# EAGLE design AnalogFrontend_v1 (EAGLE 9.6.2)

## Sheet 1 of 5: MAIN
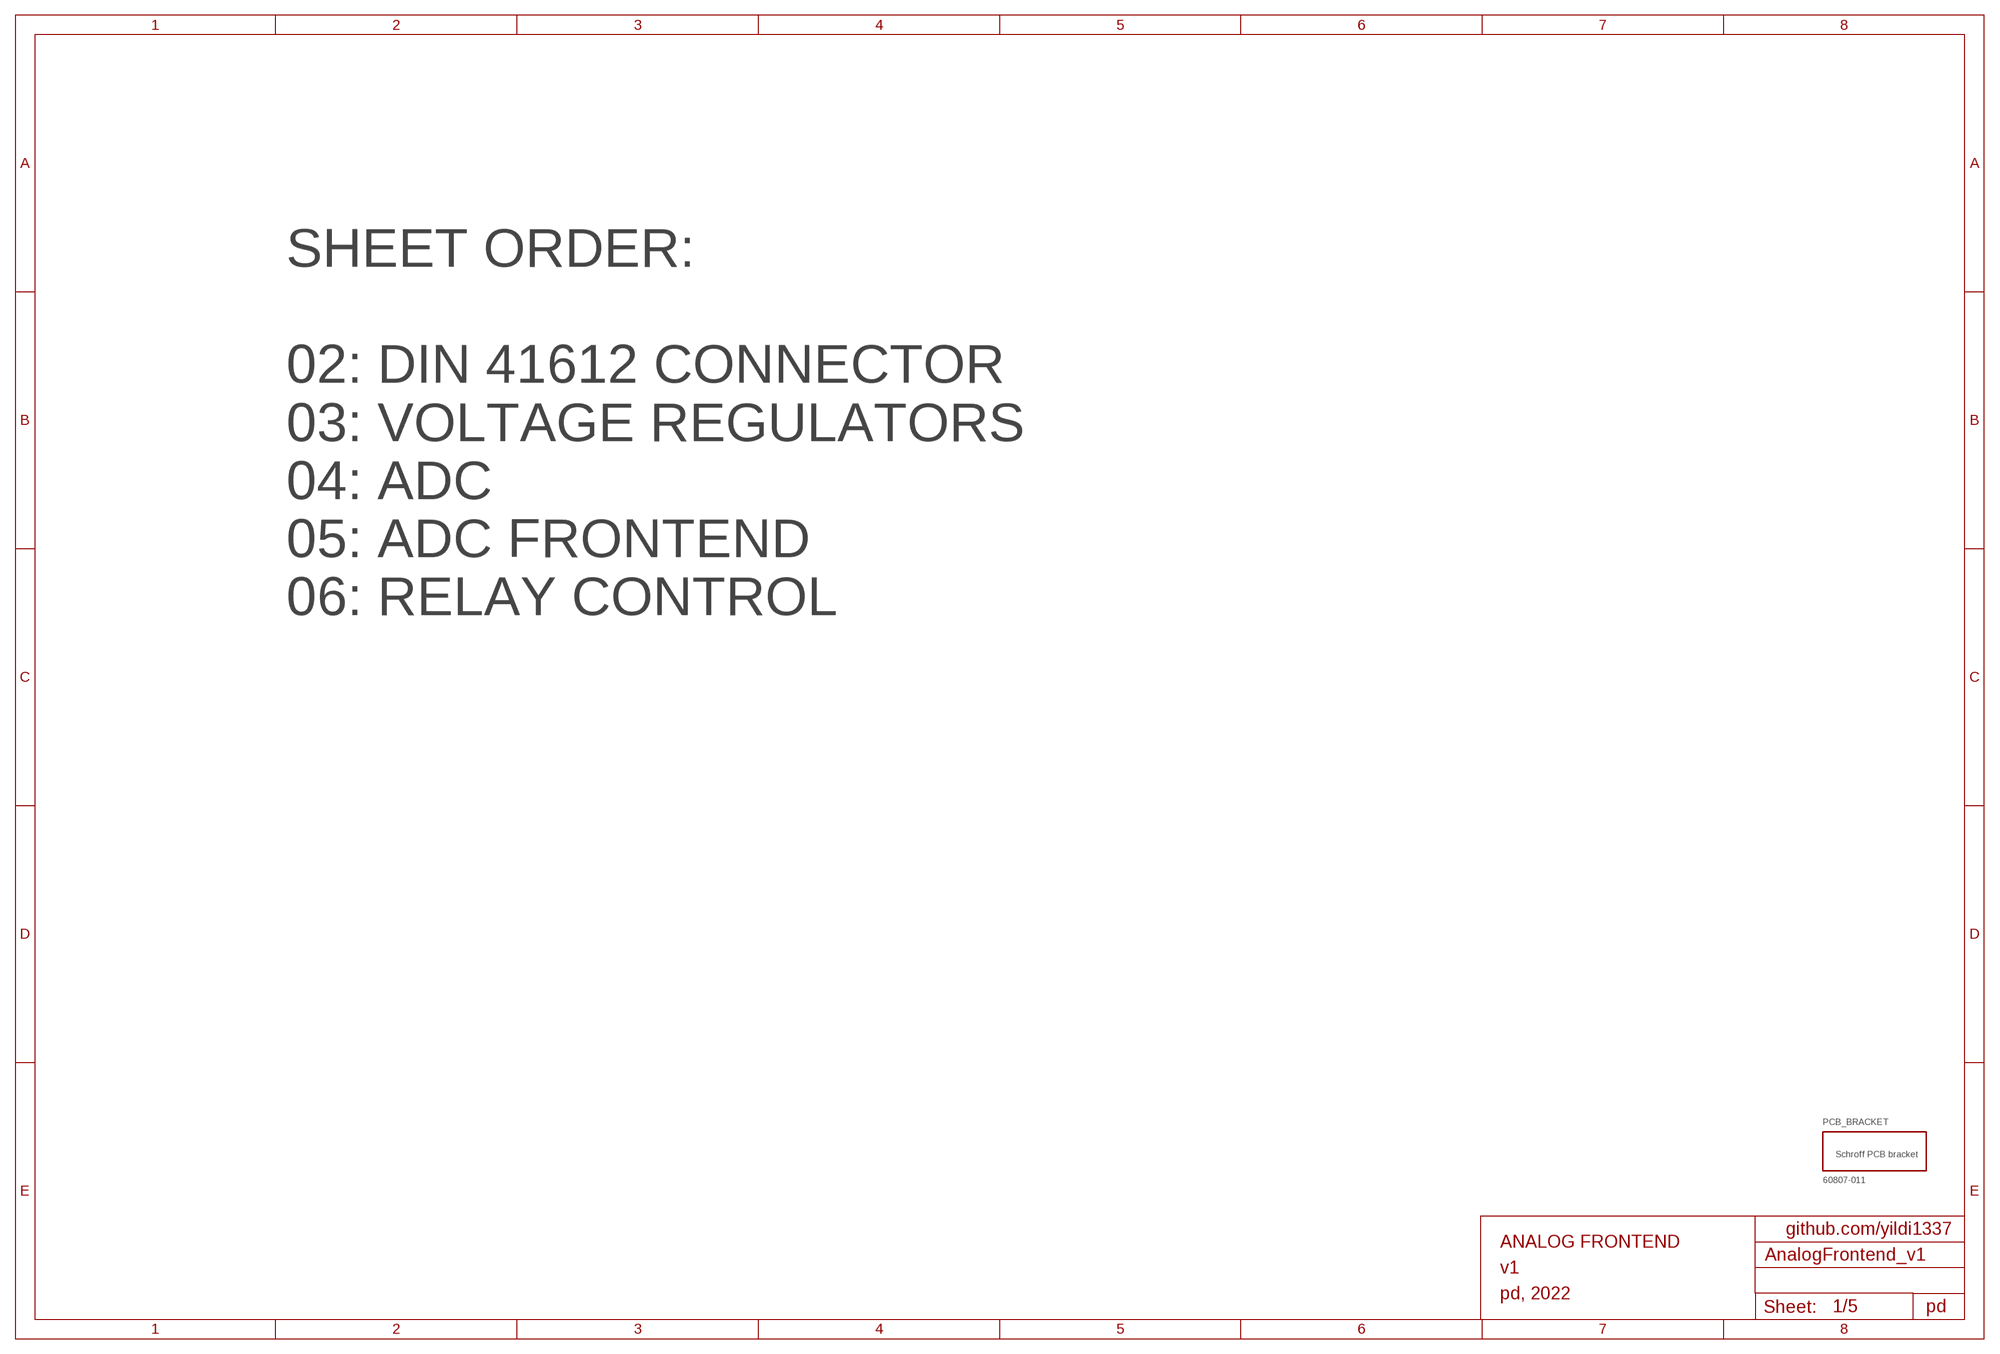
[diagram p0: schematic, sheet 1]

### Parts
PCB_BRACKET  60807-011  [60807-011]

### Notes on the sheet
- SHEET ORDER:
  
  02: DIN 41612 CONNECTOR
  03: VOLTAGE REGULATORS
  04: ADC
  05: ADC FRONTEND
  06: RELAY CONTROL
- github.com/yildi1337
- ANALOG FRONTEND
- v1
- pd, 2022
- pd

## Sheet 2 of 5: DIN 41612 CONNECTOR
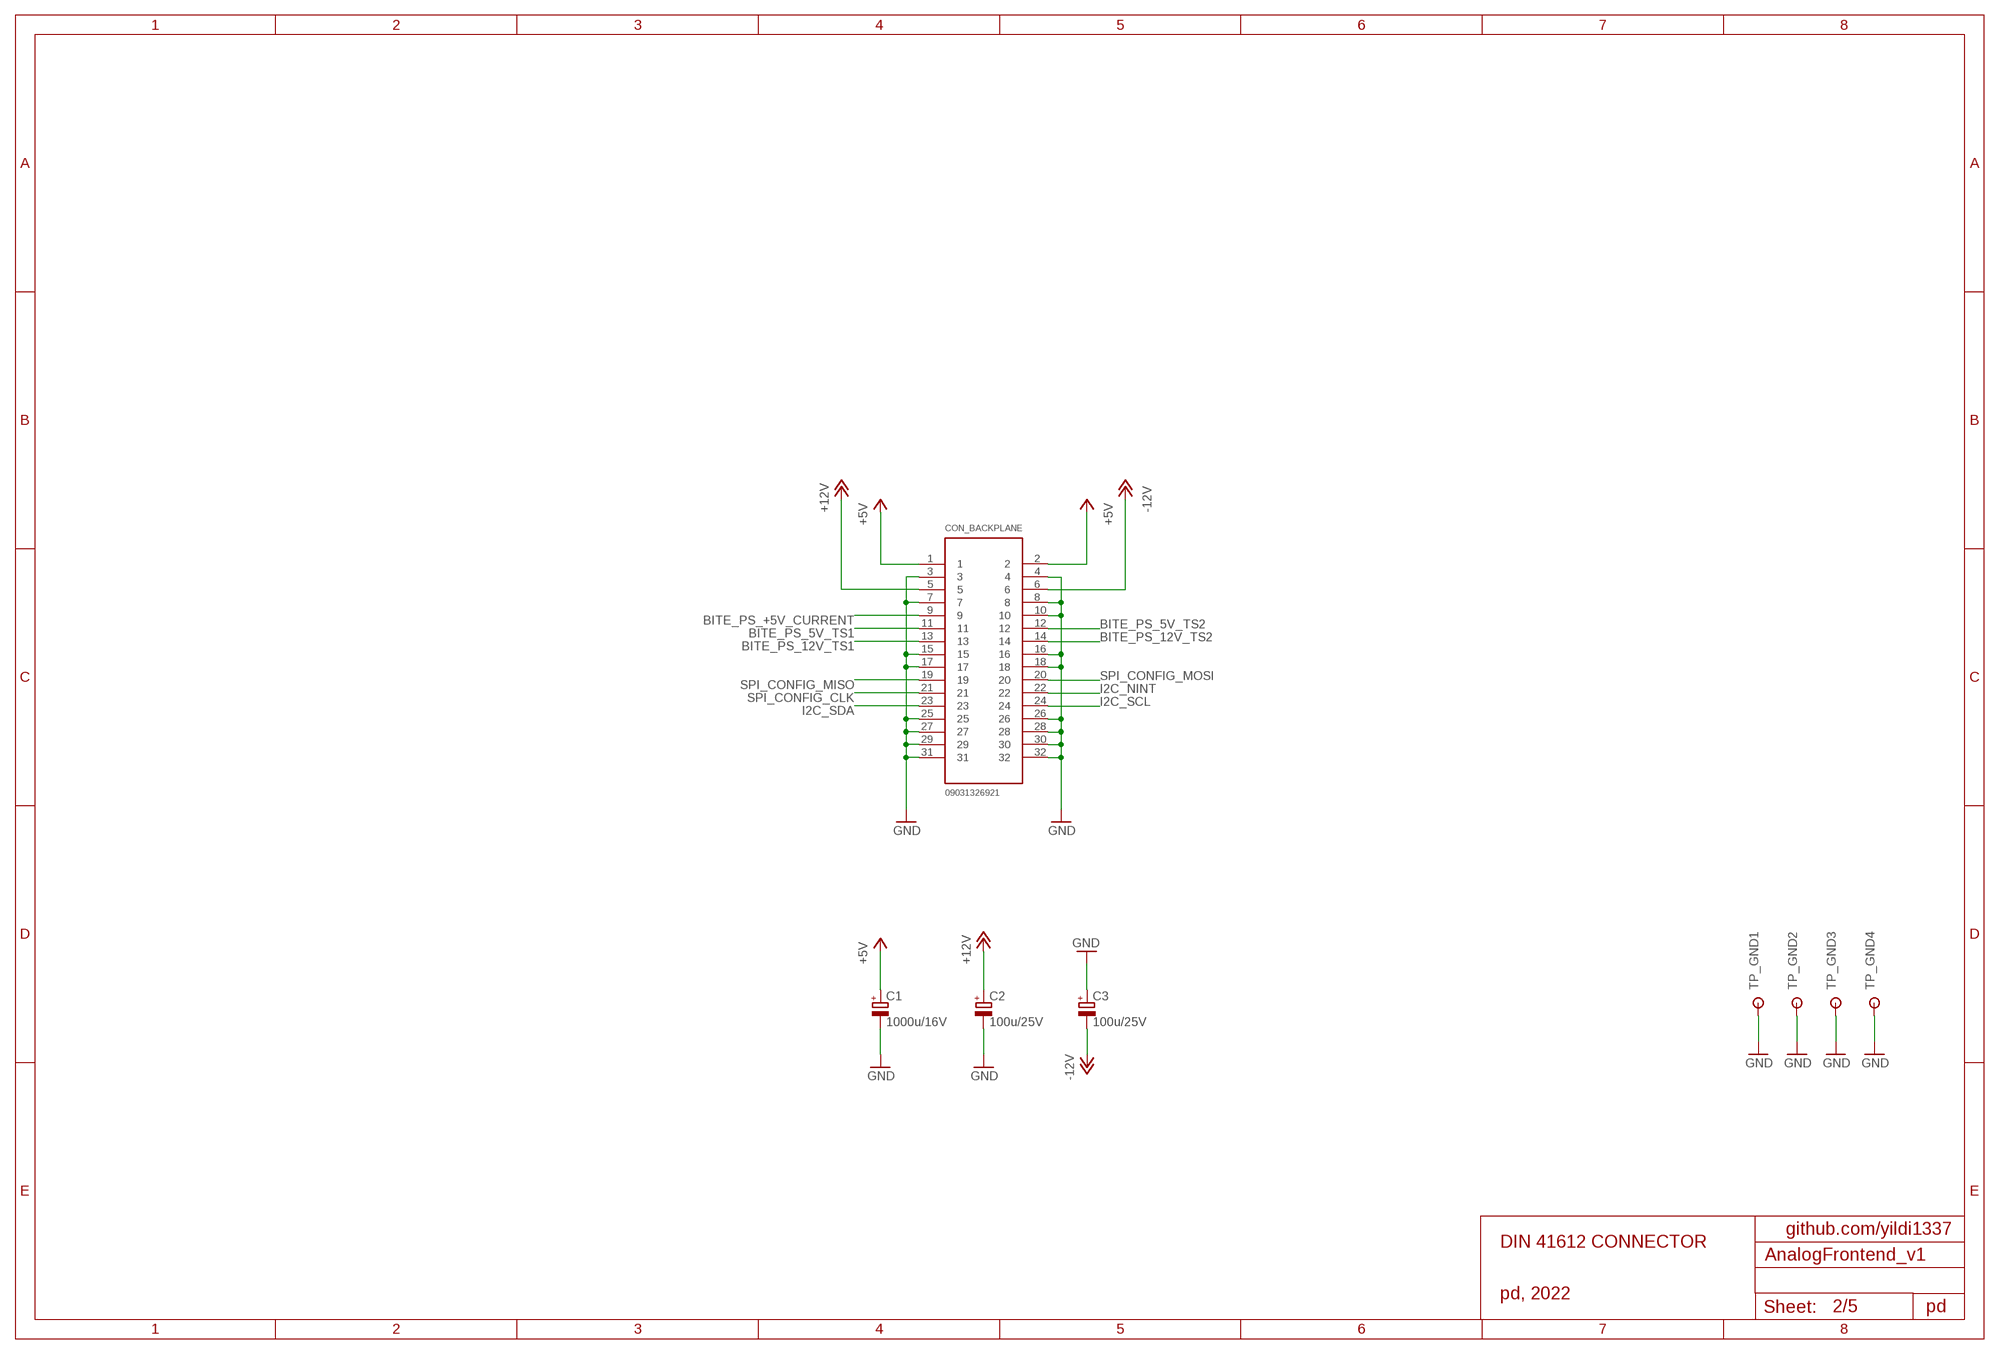
[diagram p1: schematic, sheet 2]

### Parts
C1  1000u/16V  CPOL-EU153CLV-1010  [153CLV-1010]
C2  100u/25V  CPOL-EU153CLV-0810  [153CLV-0810]
C3  100u/25V  CPOL-EU153CLV-0810  [153CLV-0810]
CON_BACKPLANE  09031326921  [09031326921]
TP_GND1  RSPRO-1MM-TERMINAL-POST-2622034  [RSPRO-1MM-TERMINAL-POST-2622034]
TP_GND2  RSPRO-1MM-TERMINAL-POST-2622034  [RSPRO-1MM-TERMINAL-POST-2622034]
TP_GND3  RSPRO-1MM-TERMINAL-POST-2622034  [RSPRO-1MM-TERMINAL-POST-2622034]
TP_GND4  RSPRO-1MM-TERMINAL-POST-2622034  [RSPRO-1MM-TERMINAL-POST-2622034]

### Nets
+5V: C1.+ CON_BACKPLANE.1 CON_BACKPLANE.2 ; also sheet 3,4,5
+12V: C2.+ CON_BACKPLANE.5 ; also sheet 3
-12V: C3.- CON_BACKPLANE.6 ; also sheet 3
BITE_PS_5V_TS1: CON_BACKPLANE.11
BITE_PS_5V_TS2: CON_BACKPLANE.12
BITE_PS_12V_TS1: CON_BACKPLANE.13
BITE_PS_12V_TS2: CON_BACKPLANE.14
BITE_PS_+5V_CURRENT: CON_BACKPLANE.9
GND: C1.- C2.- C3.+ CON_BACKPLANE.3 CON_BACKPLANE.4 CON_BACKPLANE.7 CON_BACKPLANE.8 CON_BACKPLANE.10 CON_BACKPLANE.15 CON_BACKPLANE.16 CON_BACKPLANE.17 CON_BACKPLANE.18 CON_BACKPLANE.25 CON_BACKPLANE.26 CON_BACKPLANE.27 CON_BACKPLANE.28 CON_BACKPLANE.29 CON_BACKPLANE.30 CON_BACKPLANE.31 CON_BACKPLANE.32 TP_GND1.P$1 TP_GND2.P$1 TP_GND3.P$1 TP_GND4.P$1 ; also sheet 3,4,5
I2C_NINT: CON_BACKPLANE.22 ; also sheet 5
I2C_SCL: CON_BACKPLANE.24 ; also sheet 5
I2C_SDA: CON_BACKPLANE.23 ; also sheet 5
SPI_CONFIG_CLK: CON_BACKPLANE.21 ; also sheet 5
SPI_CONFIG_MISO: CON_BACKPLANE.19 ; also sheet 5
SPI_CONFIG_MOSI: CON_BACKPLANE.20 ; also sheet 5

### Notes on the sheet
- github.com/yildi1337
- DIN 41612 CONNECTOR
- pd, 2022
- pd

## Sheet 3 of 5: VOLTAGE REGULATORS
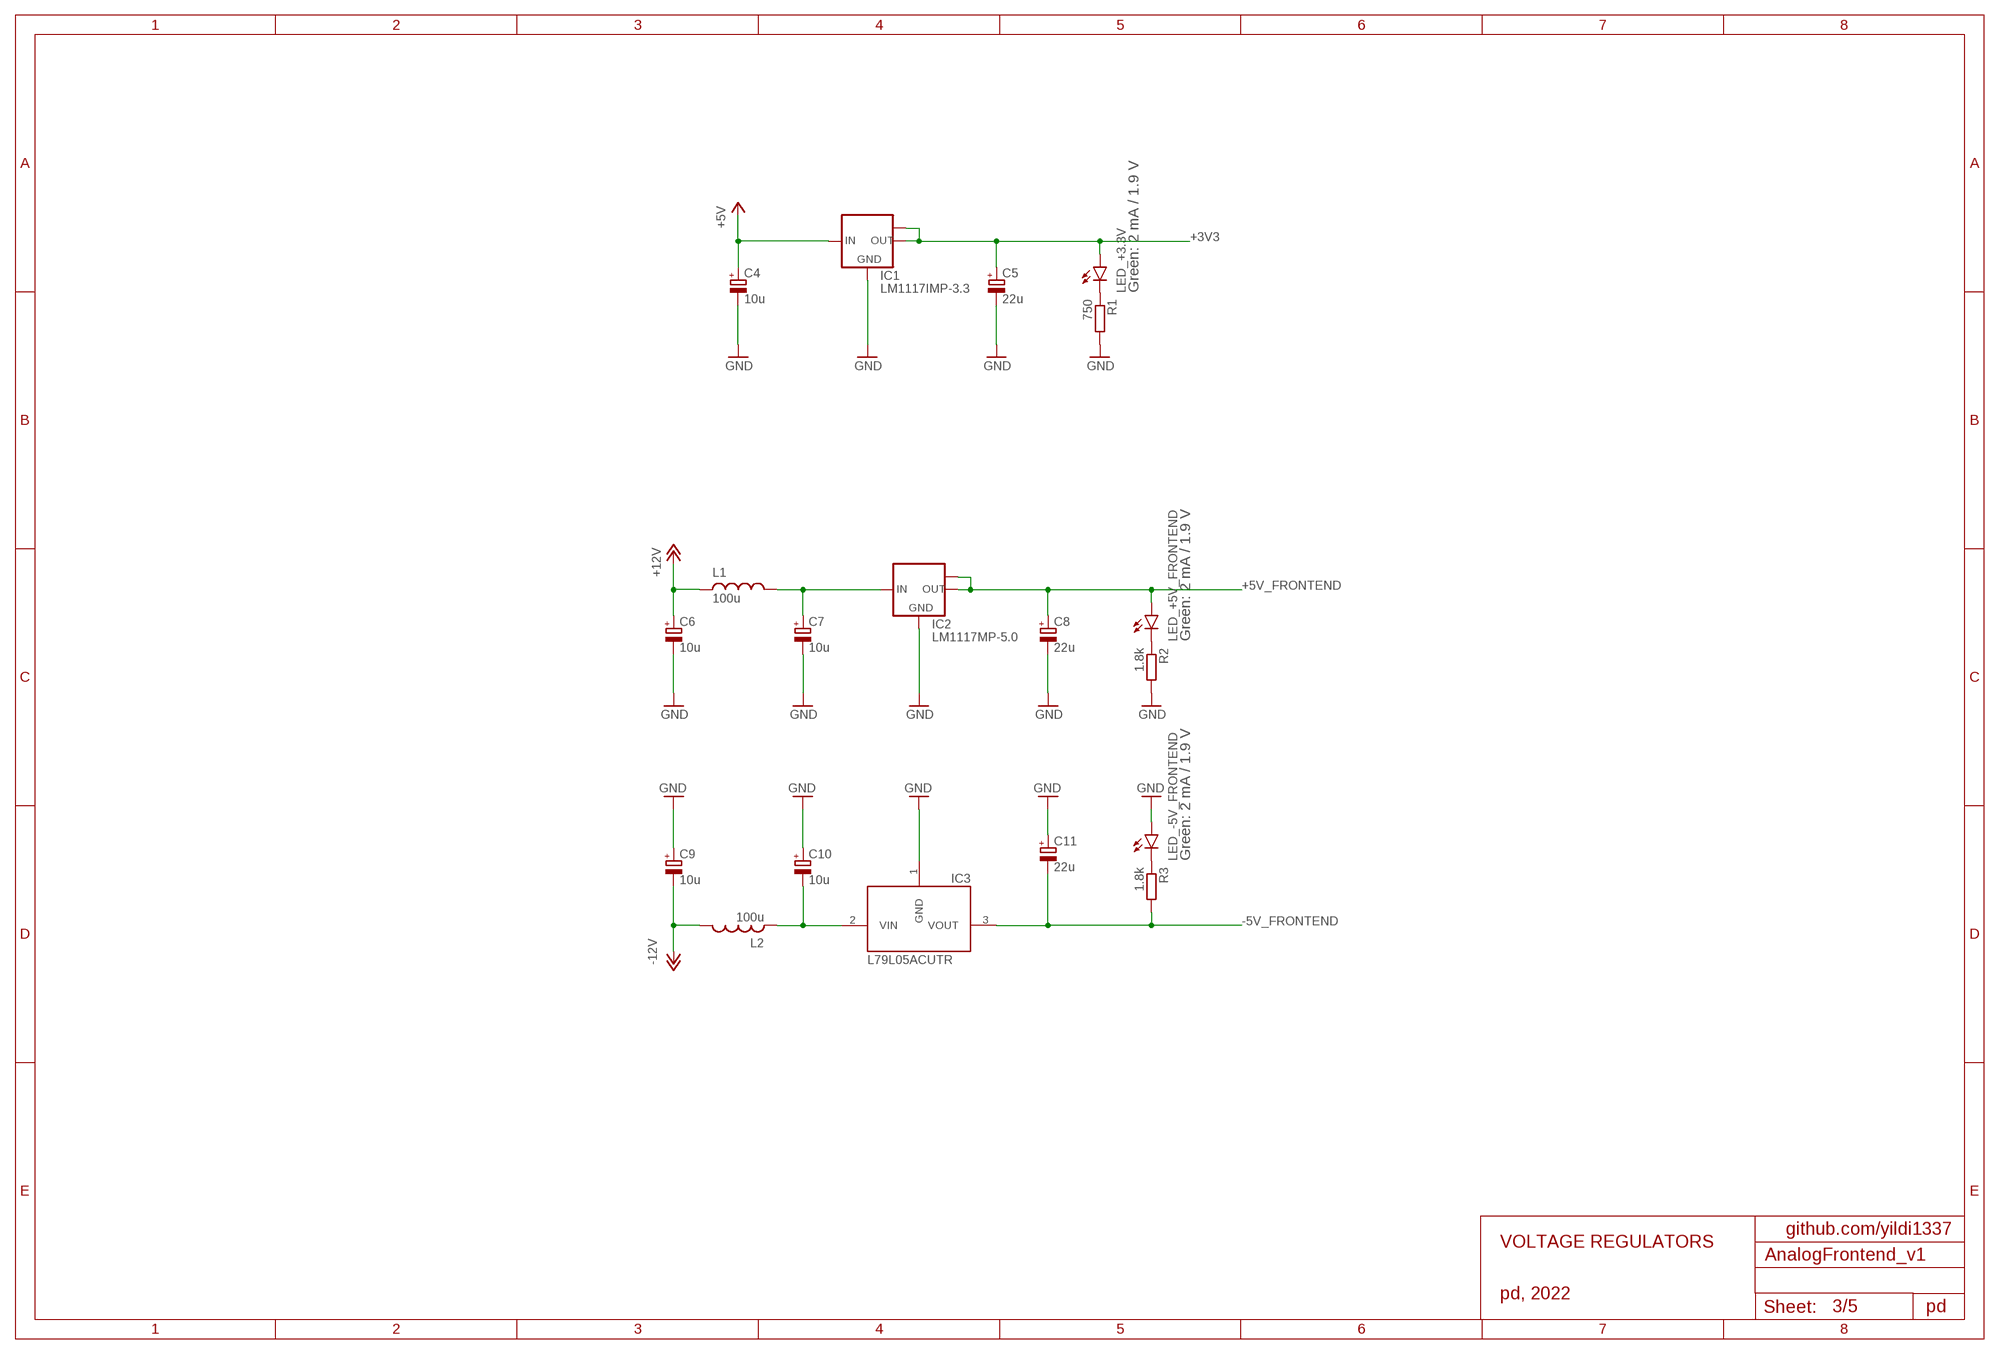
[diagram p2: schematic, sheet 3]

### Parts
C4  10u  CPOL-EUCT3216  [CT3216]
C5  22u  CPOL-EUCT6032  [CT6032]
C6  10u  CPOL-EUCT3216  [CT3216]
C7  10u  CPOL-EUCT3216  [CT3216]
C8  22u  CPOL-EUCT6032  [CT6032]
C9  10u  CPOL-EUCT3216  [CT3216]
C10  10u  CPOL-EUCT3216  [CT3216]
C11  22u  CPOL-EUCT6032  [CT6032]
IC1  LM1117IMP-3.3  LM1117IMPX-3.3  [SOT223]
IC2  LM1117MP-5.0  LM1117MPX-5.0  [SOT223]
IC3  L79L05ACUTR  [L79L05ACUTR]
L1  100u  VLS6045AF-101M  [VLS6045AF-101M]
L2  100u  VLS6045AF-101M  [VLS6045AF-101M]
LED_+3.3V  LEDCHIP-LED0603  [CHIP-LED0603]
LED_+5V_FRONTEND  LEDCHIP-LED0603  [CHIP-LED0603]
LED_-5V_FRONTEND  LEDCHIP-LED0603  [CHIP-LED0603]
R1  750  R-EU_R0603  [R0603]
R2  1.8k  R-EU_R0603  [R0603]
R3  1.8k  R-EU_R0603  [R0603]

### Nets
+3V3: C5.+ IC1.2(OUT) IC1.TAB(OUT1) LED_+3.3V.A ; also sheet 5
+5V: C4.+ IC1.3(IN) ; also sheet 2,4,5
+5V_FRONTEND: C8.+ IC2.2(OUT) IC2.TAB(OUT1) LED_+5V_FRONTEND.A ; also sheet 4
+12V: C6.+ L1.1 ; also sheet 2
-5V_FRONTEND: C11.- IC3.3(VOUT) R3.2 ; also sheet 4
-12V: C9.- L2.2 ; also sheet 2
GND: C4.- C5.- C6.- C7.- C8.- C9.+ C10.+ C11.+ IC1.1(GND) IC2.1(GND) IC3.1(GND) LED_-5V_FRONTEND.A R1.2 R2.2 ; also sheet 2,4,5
N$12: LED_+5V_FRONTEND.C R2.1
N$13: C7.+ IC2.3(IN) L1.2
N$15: C10.- IC3.2(VIN) L2.1
N$23: LED_-5V_FRONTEND.C R3.1
N$49: LED_+3.3V.C R1.1

### Notes on the sheet
- Green: 2 mA / 1.9 V
- Green: 2 mA / 1.9 V
- Green: 2 mA / 1.9 V
- github.com/yildi1337
- VOLTAGE REGULATORS
- pd, 2022
- pd

## Sheet 4 of 5: ADC FRONTEND
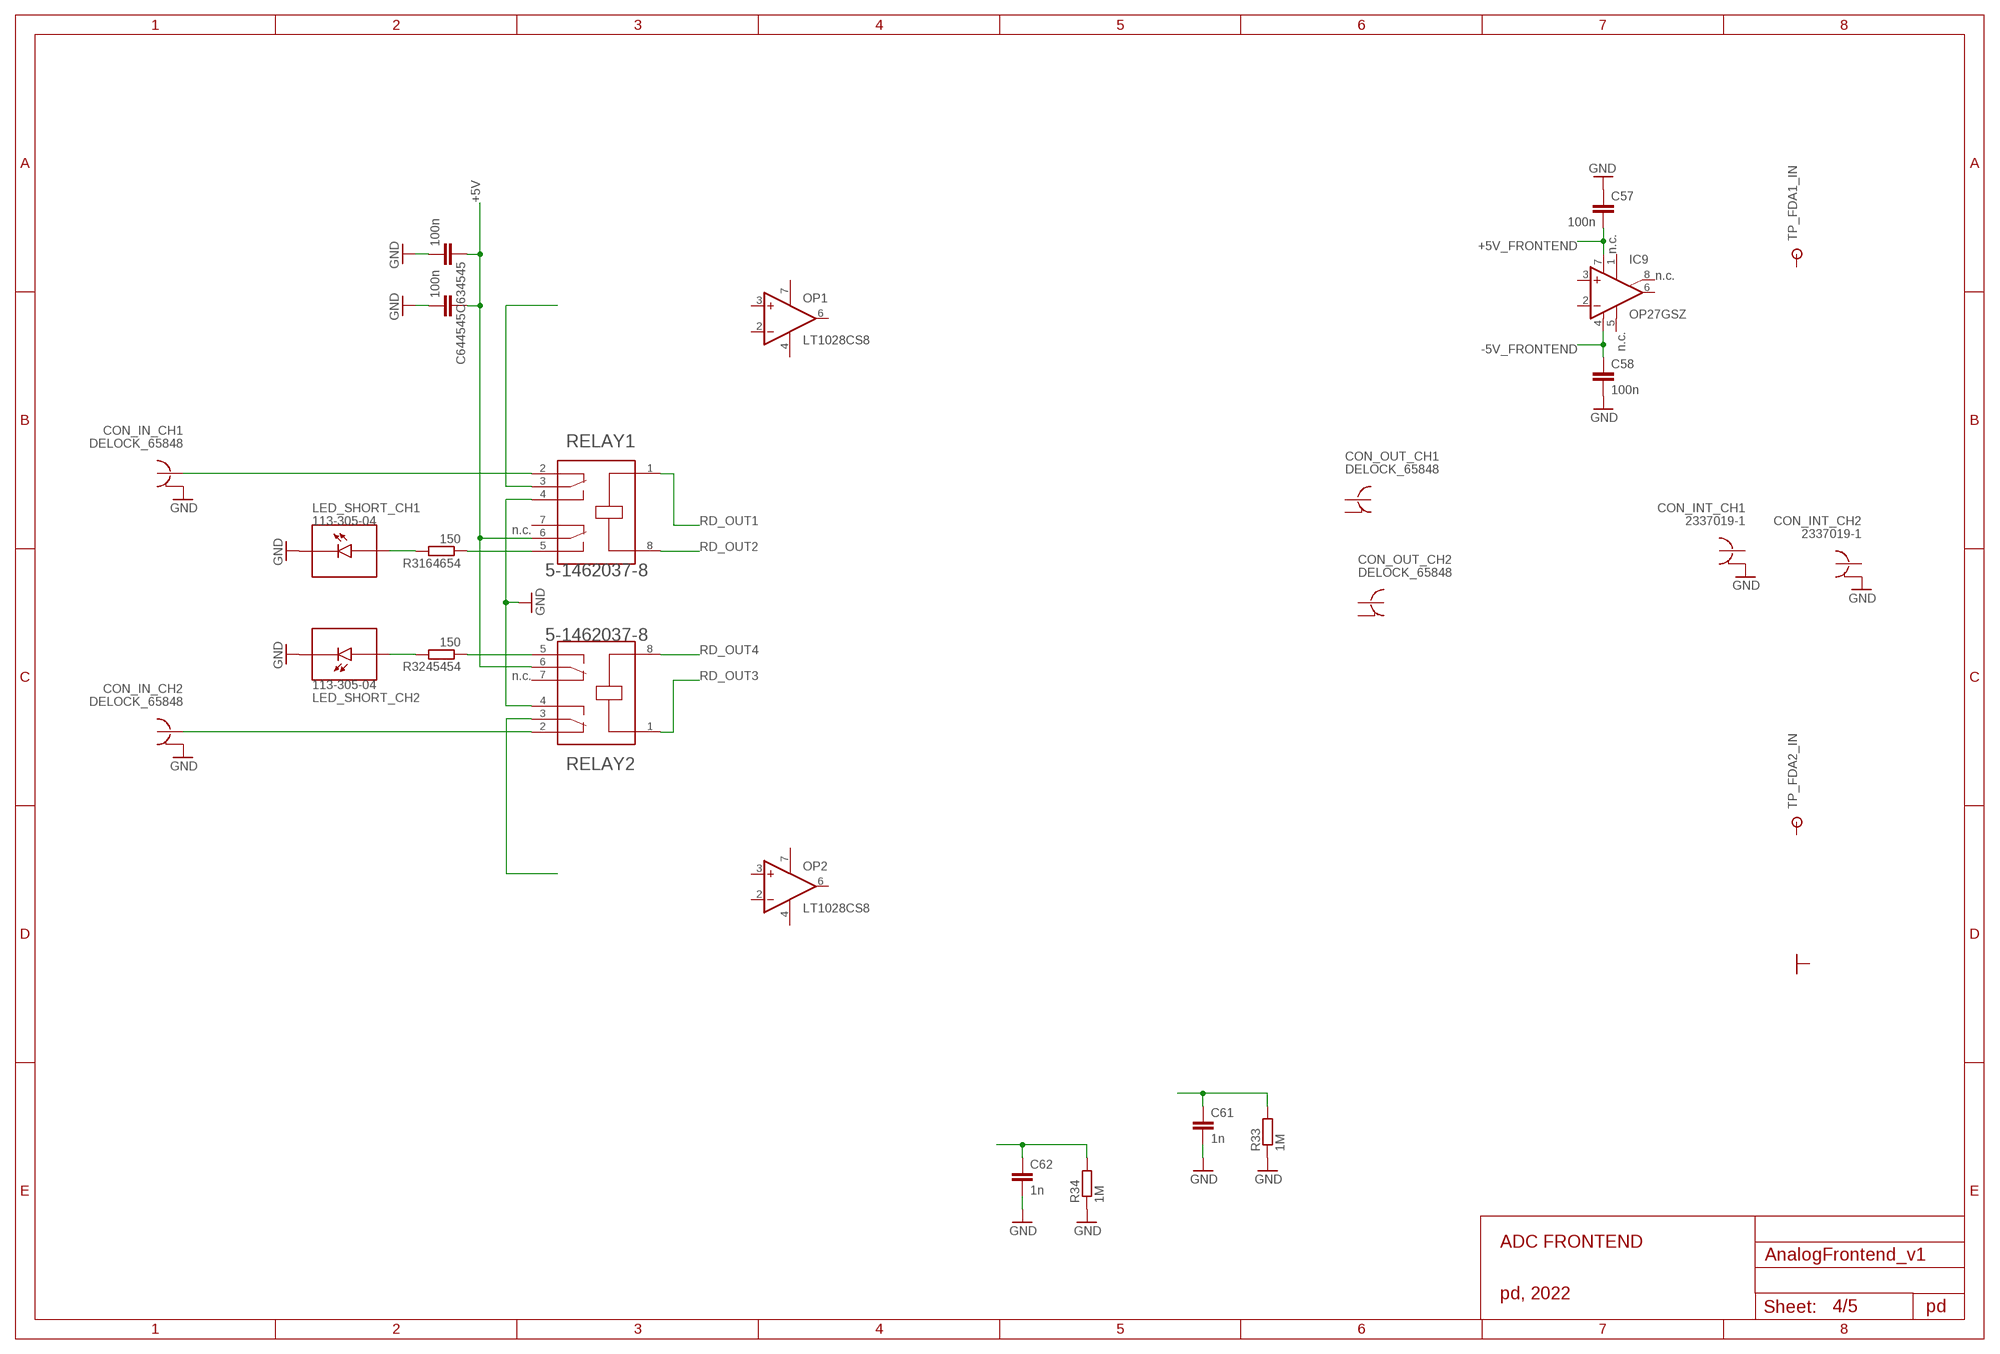
[diagram p3: schematic, sheet 4]

### Parts
C57  100n  C-EUC0603  [C0603]
C58  100n  C-EUC0603  [C0603]
C61  1n  C-EUC0603  [C0603]
C62  1n  C-EUC0603  [C0603]
C634545  100n  C-EUC0603  [C0603]
C644545  100n  C-EUC0603  [C0603]
CON_IN_CH1  DELOCK_65848  [DELOCK_65848]
CON_IN_CH2  DELOCK_65848  [DELOCK_65848]
CON_INT_CH1  2337019-1  [2337019-1]
CON_INT_CH2  2337019-1  [2337019-1]
CON_OUT_CH1  DELOCK_65848  [DELOCK_65848]
CON_OUT_CH2  DELOCK_65848  [DELOCK_65848]
IC9  OP27GSZ  OP27D  [SO08]
LED_SHORT_CH1  113-305-04  [113-305-04]
LED_SHORT_CH2  113-305-04  [113-305-04]
OP1  LT1028CS8  [LT1028CS8]
OP2  LT1028CS8  [LT1028CS8]
R33  1M  R-EU_R0603  [R0603]
R34  1M  R-EU_R0603  [R0603]
R3164654  150  R-EU_R0603  [R0603]
R3245454  150  R-EU_R0603  [R0603]
RELAY1  5-1462037-8  [5-1462037-8]
RELAY2  5-1462037-8  [5-1462037-8]
TP_FDA1_IN  RSPRO-1MM-TERMINAL-POST-2622034  [RSPRO-1MM-TERMINAL-POST-2622034]
TP_FDA2_IN  RSPRO-1MM-TERMINAL-POST-2622034  [RSPRO-1MM-TERMINAL-POST-2622034]

### Nets
+5V: C634545.1 C644545.1 RELAY1.6 RELAY2.6 ; also sheet 2,3,5
+5V_FRONTEND: C57.2 IC9.7(V+) ; also sheet 3
-5V_FRONTEND: C58.1 IC9.4(V-) ; also sheet 3
GND: C57.1 C58.2 C61.2 C62.2 C634545.2 C644545.2 CON_IN_CH1.G1(G) CON_IN_CH1.G2(G) CON_IN_CH1.G3(G) CON_IN_CH1.G4(G) CON_IN_CH2.G1(G) CON_IN_CH2.G2(G) CON_IN_CH2.G3(G) CON_IN_CH2.G4(G) CON_INT_CH1.G1(GND) CON_INT_CH1.G2(GND) CON_INT_CH2.G1(GND) CON_INT_CH2.G2(GND) LED_SHORT_CH1.-(C) LED_SHORT_CH2.-(C) R33.1 R34.1 RELAY1.4 RELAY2.4 ; also sheet 2,3,5
N$20: C61.1 R33.2
N$27: C62.1 R34.2
N$29: RELAY1.3
N$30: RELAY2.3
N$54: CON_IN_CH1.S RELAY1.2
N$55: CON_IN_CH2.S RELAY2.2
N$56: LED_SHORT_CH1.+(A) R3164654.2
N$58: LED_SHORT_CH2.+(A) R3245454.2
N$59: R3245454.1 RELAY2.5
N$60: R3164654.1 RELAY1.5
RD_OUT1: RELAY1.1 ; also sheet 5
RD_OUT2: RELAY1.8 ; also sheet 5
RD_OUT3: RELAY2.1 ; also sheet 5
RD_OUT4: RELAY2.8 ; also sheet 5
Unconnected: CON_INT_CH1.S(SIG) CON_INT_CH2.S(SIG) CON_OUT_CH1.G1(G) CON_OUT_CH1.G2(G) CON_OUT_CH1.G3(G) CON_OUT_CH1.G4(G) CON_OUT_CH1.S CON_OUT_CH2.G1(G) CON_OUT_CH2.G2(G) CON_OUT_CH2.G3(G) CON_OUT_CH2.G4(G) CON_OUT_CH2.S IC9.1(ON1) IC9.2(-IN) IC9.3(+IN) IC9.5(OPT) IC9.6(OUT) IC9.8(ON2) OP1.2(-IN) OP1.3(+IN) OP1.6(OUT) OP2.2(-IN) OP2.3(+IN) OP2.6(OUT) RELAY1.7 RELAY2.7 TP_FDA1_IN.P$1 TP_FDA2_IN.P$1

### Notes on the sheet
- n.c.
- n.c.
- n.c.
- n.c.
- n.c.
- ADC FRONTEND
- pd, 2022
- pd

## Sheet 5 of 5: RELAY CONTROL
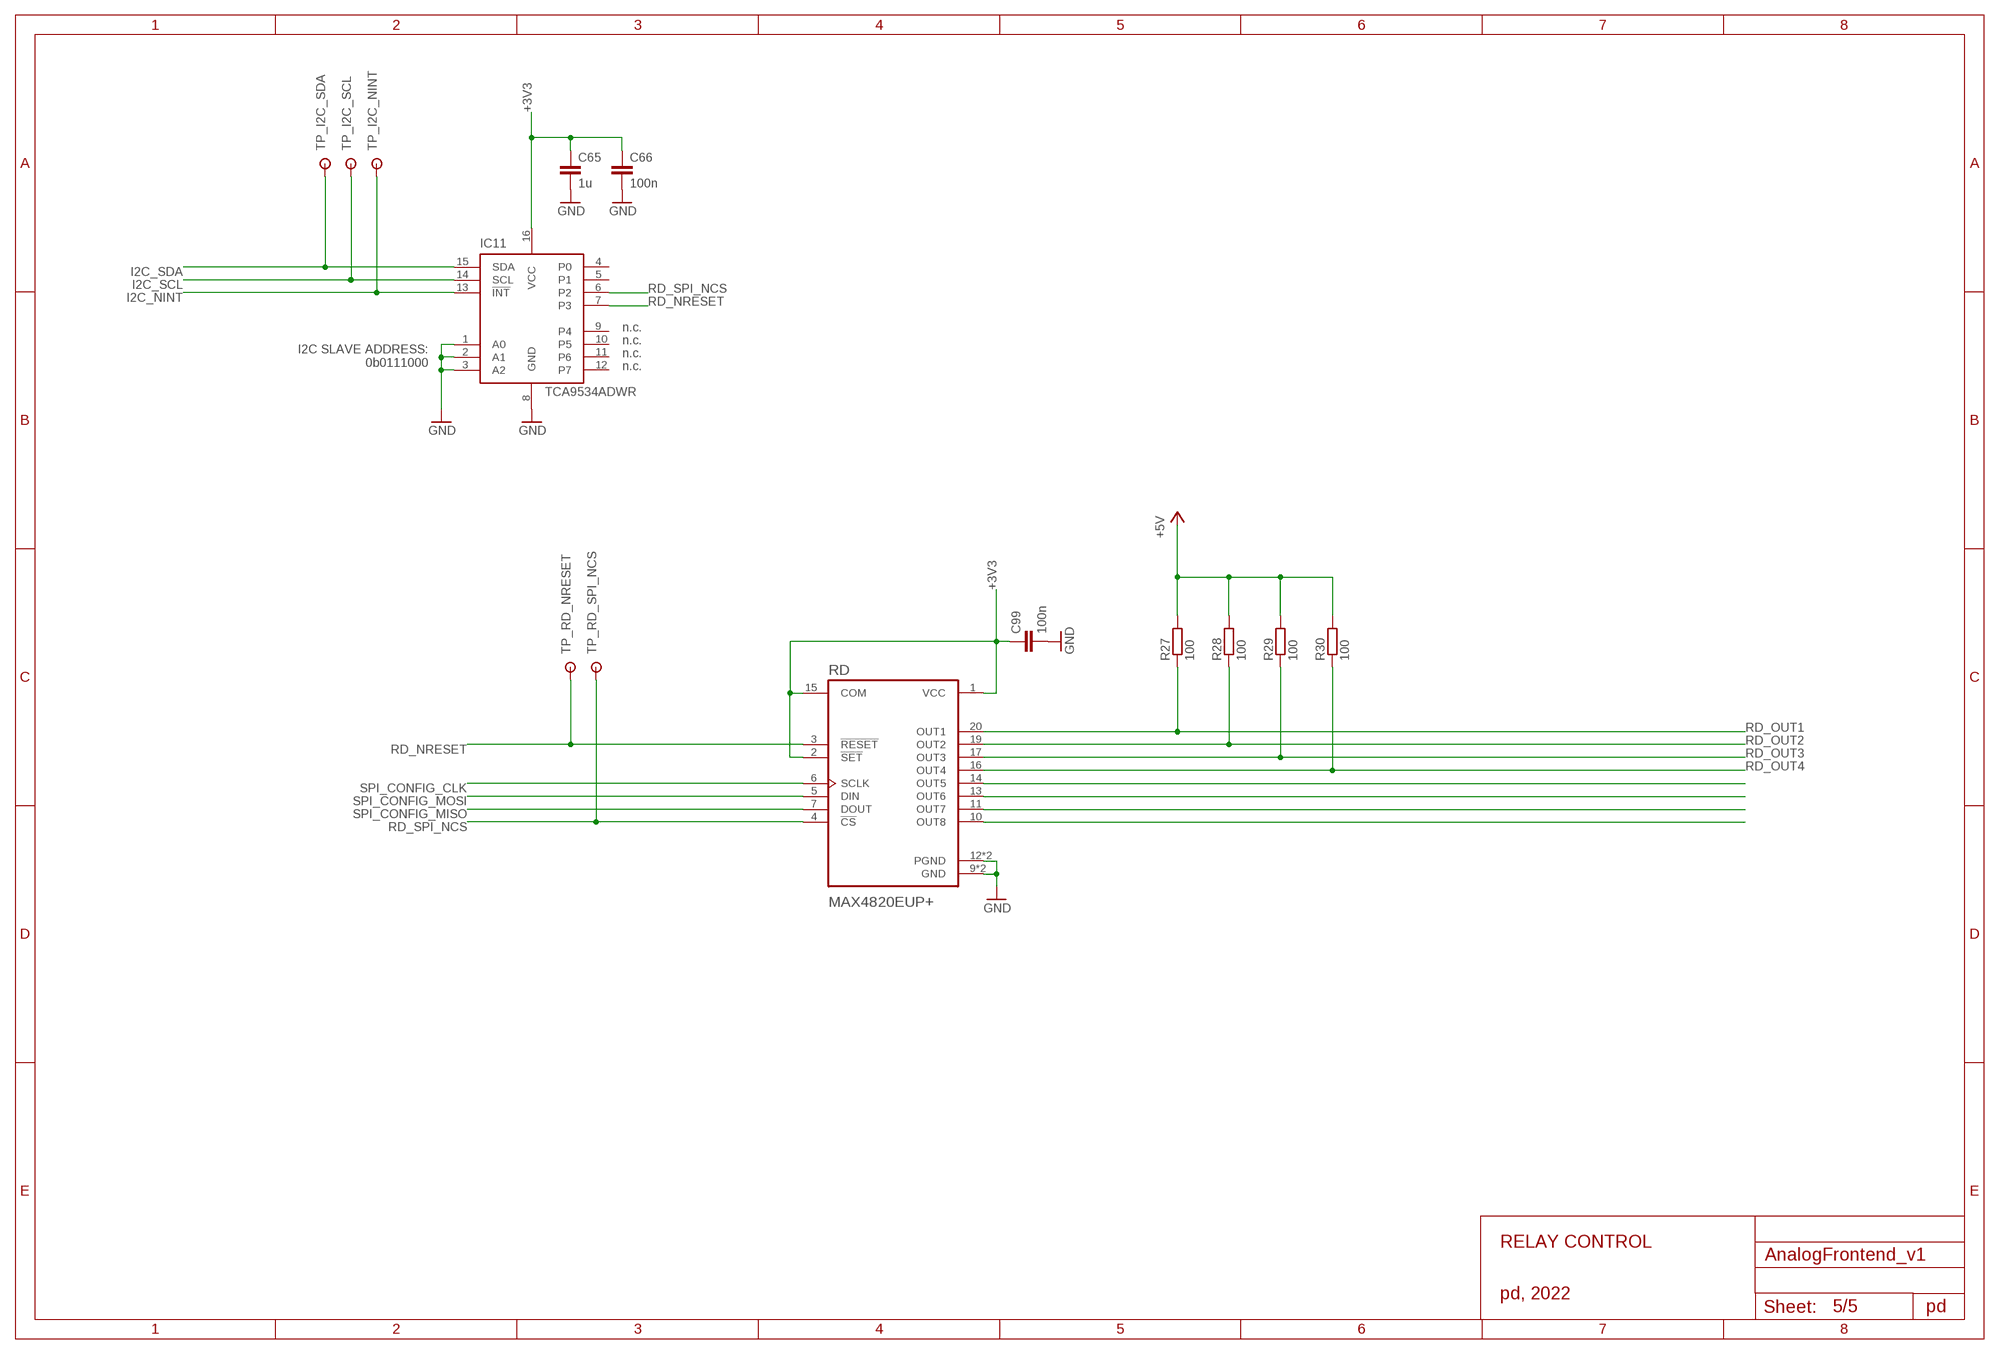
[diagram p4: schematic, sheet 5]

### Parts
C65  1u  C-EUC0603  [C0603]
C66  100n  C-EUC0603  [C0603]
C99  100n  C-EUC0603  [C0603]
IC11  TCA9534ADWR  [TCA9534ADWR]
R27  100  R-EU_R0603  [R0603]
R28  100  R-EU_R0603  [R0603]
R29  100  R-EU_R0603  [R0603]
R30  100  R-EU_R0603  [R0603]
RD  MAX4820EUP+  [MAX4820EUP+]
TP_I2C_NINT  RSPRO-1MM-TERMINAL-POST-2622034  [RSPRO-1MM-TERMINAL-POST-2622034]
TP_I2C_SCL  RSPRO-1MM-TERMINAL-POST-2622034  [RSPRO-1MM-TERMINAL-POST-2622034]
TP_I2C_SDA  RSPRO-1MM-TERMINAL-POST-2622034  [RSPRO-1MM-TERMINAL-POST-2622034]
TP_RD_NRESET  RSPRO-1MM-TERMINAL-POST-2622034  [RSPRO-1MM-TERMINAL-POST-2622034]
TP_RD_SPI_NCS  RSPRO-1MM-TERMINAL-POST-2622034  [RSPRO-1MM-TERMINAL-POST-2622034]

### Nets
+3V3: C65.1 C66.1 C99.1 IC11.16(VCC) RD.1(VCC) RD.2(!SET) RD.15(COM) ; also sheet 3
+5V: R27.2 R28.2 R29.2 R30.2 ; also sheet 2,3,4
GND: C65.2 C66.2 C99.2 IC11.1(A0) IC11.2(A1) IC11.3(A2) IC11.8(GND) RD.9(GND) RD.12(PGND) RD.18(PGND) RD.21(GND) ; also sheet 2,3,4
I2C_NINT: IC11.13(!INT) TP_I2C_NINT.P$1 ; also sheet 2
I2C_SCL: IC11.14(SCL) TP_I2C_SCL.P$1 ; also sheet 2
I2C_SDA: IC11.15(SDA) TP_I2C_SDA.P$1 ; also sheet 2
N$1: RD.14(OUT5)
N$2: RD.13(OUT6)
N$3: RD.11(OUT7)
N$4: RD.10(OUT8)
RD_NRESET: IC11.7(P3) RD.3(!RESET) TP_RD_NRESET.P$1
RD_OUT1: R27.1 RD.20(OUT1) ; also sheet 4
RD_OUT2: R28.1 RD.19(OUT2) ; also sheet 4
RD_OUT3: R29.1 RD.17(OUT3) ; also sheet 4
RD_OUT4: R30.1 RD.16(OUT4) ; also sheet 4
RD_SPI_NCS: IC11.6(P2) RD.4(!CS) TP_RD_SPI_NCS.P$1
SPI_CONFIG_CLK: RD.6(SCLK) ; also sheet 2
SPI_CONFIG_MISO: RD.7(DOUT) ; also sheet 2
SPI_CONFIG_MOSI: RD.5(DIN) ; also sheet 2
Unconnected: IC11.4(P0) IC11.5(P1) IC11.9(P4) IC11.10(P5) IC11.11(P6) IC11.12(P7)

### Notes on the sheet
- n.c.
- I2C SLAVE ADDRESS:
  0b0111000
- n.c.
- n.c.
- n.c.
- RELAY CONTROL
- pd, 2022
- pd

## Power pins joined to a net without a drawn wire
V+: OP1.7(V+) OP2.7(V+)
V-: OP1.4(V-) OP2.4(V-)

## Library data of the parts
C1-C3 = rcl:CPOL-EU: POLARIZED CAPACITOR, European symbol; SPICEPREFIX: C
C4-C11 = RCL:CPOL-EU: POLARIZED CAPACITOR, European symbol; SPICEPREFIX: C
C57 C58 C61 C62 C65 C66 C99 C634545 C644545 = RCL:C-EU: CAPACITOR, European symbol; SPICEPREFIX: C
CON_BACKPLANE = 09031326921:09031326921
CON_IN_CH1 CON_IN_CH2 CON_OUT_CH1 CON_OUT_CH2 = DELOCK_65848:DELOCK_65848
CON_INT_CH1 CON_INT_CH2 = 2337019-1:2337019-1
IC1 = LM1117:LM1117IMPX-*
IC2 = LM1117:LM1117MPX-*
IC3 = L79L05ACUTR:L79L05ACUTR
IC9 = linear:OP27: OP AMP
IC11 = TCA9534ADWR:TCA9534ADWR
L1 L2 = VLS6045AF-101M:VLS6045AF-101M
LED_+3.3V LED_+5V_FRONTEND LED_-5V_FRONTEND = led:LED: LED OSRAM: - CHIPLED LG R971, LG N971, LY N971, LG Q971, LY Q971, LO R971, LY R971 LH N974, LH R974 LS Q976, LO Q976, LY Q976 LO Q996 - Hyper CHIPLED LW Q18S LB Q993, LB Q99A, LB R99A - SideLED LS A670, LO A670, LY A670, LG A670, LP A670 LB A673, LV A673, LT A673, LW A673 LH A674 LY A675 LS A676, LA A676, LO A676, LY A676, LW A676 LS A679, LY A679, LG A679 - Hyper Micro SIDELED® LS Y876, LA Y876, LO Y876, LY Y876 LT Y87S - SmartLED LW L88C, LW L88S LB L89C, LB L89S, LG L890 LS L89K, LO L89K, LY L89K LS L896, LA L896, LO L896, LY L896 - TOPLED LS T670, LO T670, LY T670, LG T670, LP T670 LSG T670, LSP T670, LSY T670, LOP T670, LYG T670 LG T671, LOG T671, LSG T671 LB T673, LV T673, LT T673, LW T673 LH T674 LS T676, LA T676, LO T676, LY T676, LB T676, LH T676, LSB T676, LW T676 LB T67C, LV T67C, LT T67C, LS T67K, LO T67K, LY T67K, LW E67C LS E67B, LA E67B, LO E67B, LY E67B, LB E67C, LV E67C, LT E67C LW T67C LS T679, LY T679, LG T679 LS T770, LO T770, LY T770, LG T770, LP T770 LB T773, LV T773, LT T773, LW T773 LH T774 LS E675, LA E675, LY E675, LS T675 LS T776, LA T776, LO T776, LY T776, LB T776 LHGB T686 LT T68C, LB T68C - Hyper Mini TOPLED® LB M676 - Mini TOPLED Santana® LG M470 LS M47K, LO M47K, LY M47K Source: http://www.osram.convergy.de LUXEON: - LUMILED® LXK2-PW12-R00, LXK2-PW12-S00, LXK2-PW14-U00, LXK2-PW14-V00 LXK2-PM12-R00, LXK2-PM12-S00, LXK2-PM14-U00 LXK2-PE12-Q00, LXK2-PE12-R00, LXK2-PE12-S00, LXK2-PE14-T00, LXK2-PE14-U00 LXK2-PB12-K00, LXK2-PB12-L00, LXK2-PB12-M00, LXK2-PB14-N00, LXK2-PB14-P00, LXK2-PB14-Q00 LXK2-PR12-L00, LXK2-PR12-M00, LXK2-PR14-Q00, LXK2-PR14-R00 LXK2-PD12-Q00, LXK2-PD12-R00, LXK2-PD12-S00 LXK2-PH12-R00, LXK2-PH12-S00 LXK2-PL12-P00, LXK2-PL12-Q00, LXK2-PL12-R00 Source: www.luxeon.com KINGBRIGHT: KA-3528ASYC Source: www.kingbright.com
LED_SHORT_CH1 LED_SHORT_CH2 = 113-305-04:113-305-04
OP1 OP2 = LT1028CS8:LT1028CS8
PCB_BRACKET = 60807-011:60807-011
R1-R3 R27-R30 R33 R34 R3164654 R3245454 = RCL:R-EU_: RESISTOR, European symbol; SPICEPREFIX: R
RD = MAX4820EUP+:MAX4820EUP+
RELAY1 RELAY2 = 5-1462037-8:5-1462037-8
TP_FDA1_IN TP_FDA2_IN TP_GND1-TP_GND4 TP_I2C_NINT TP_I2C_SCL TP_I2C_SDA TP_RD_NRESET TP_RD_SPI_NCS = RSPRO-1MM-TERMINAL-POST-2622034:RSPRO-1MM-TERMINAL-POST-2622034

## Board
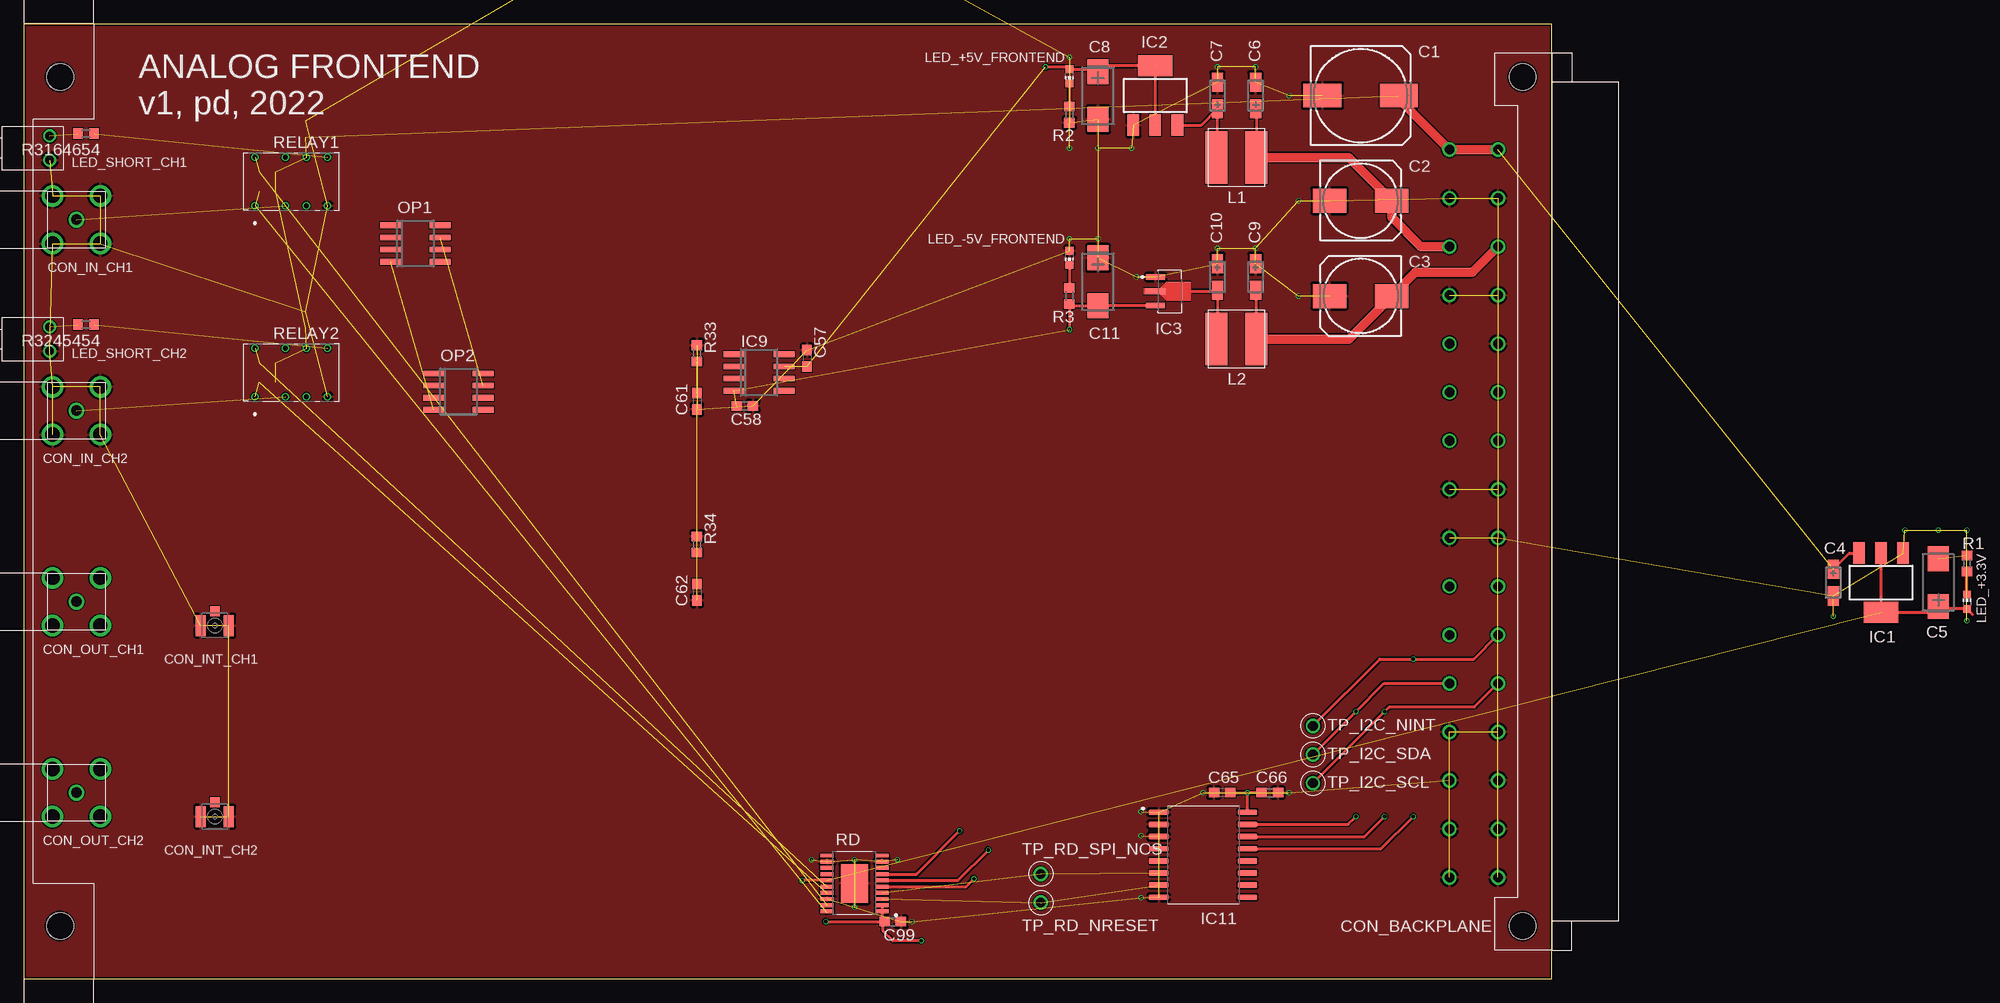
[diagram p5: board, top side]
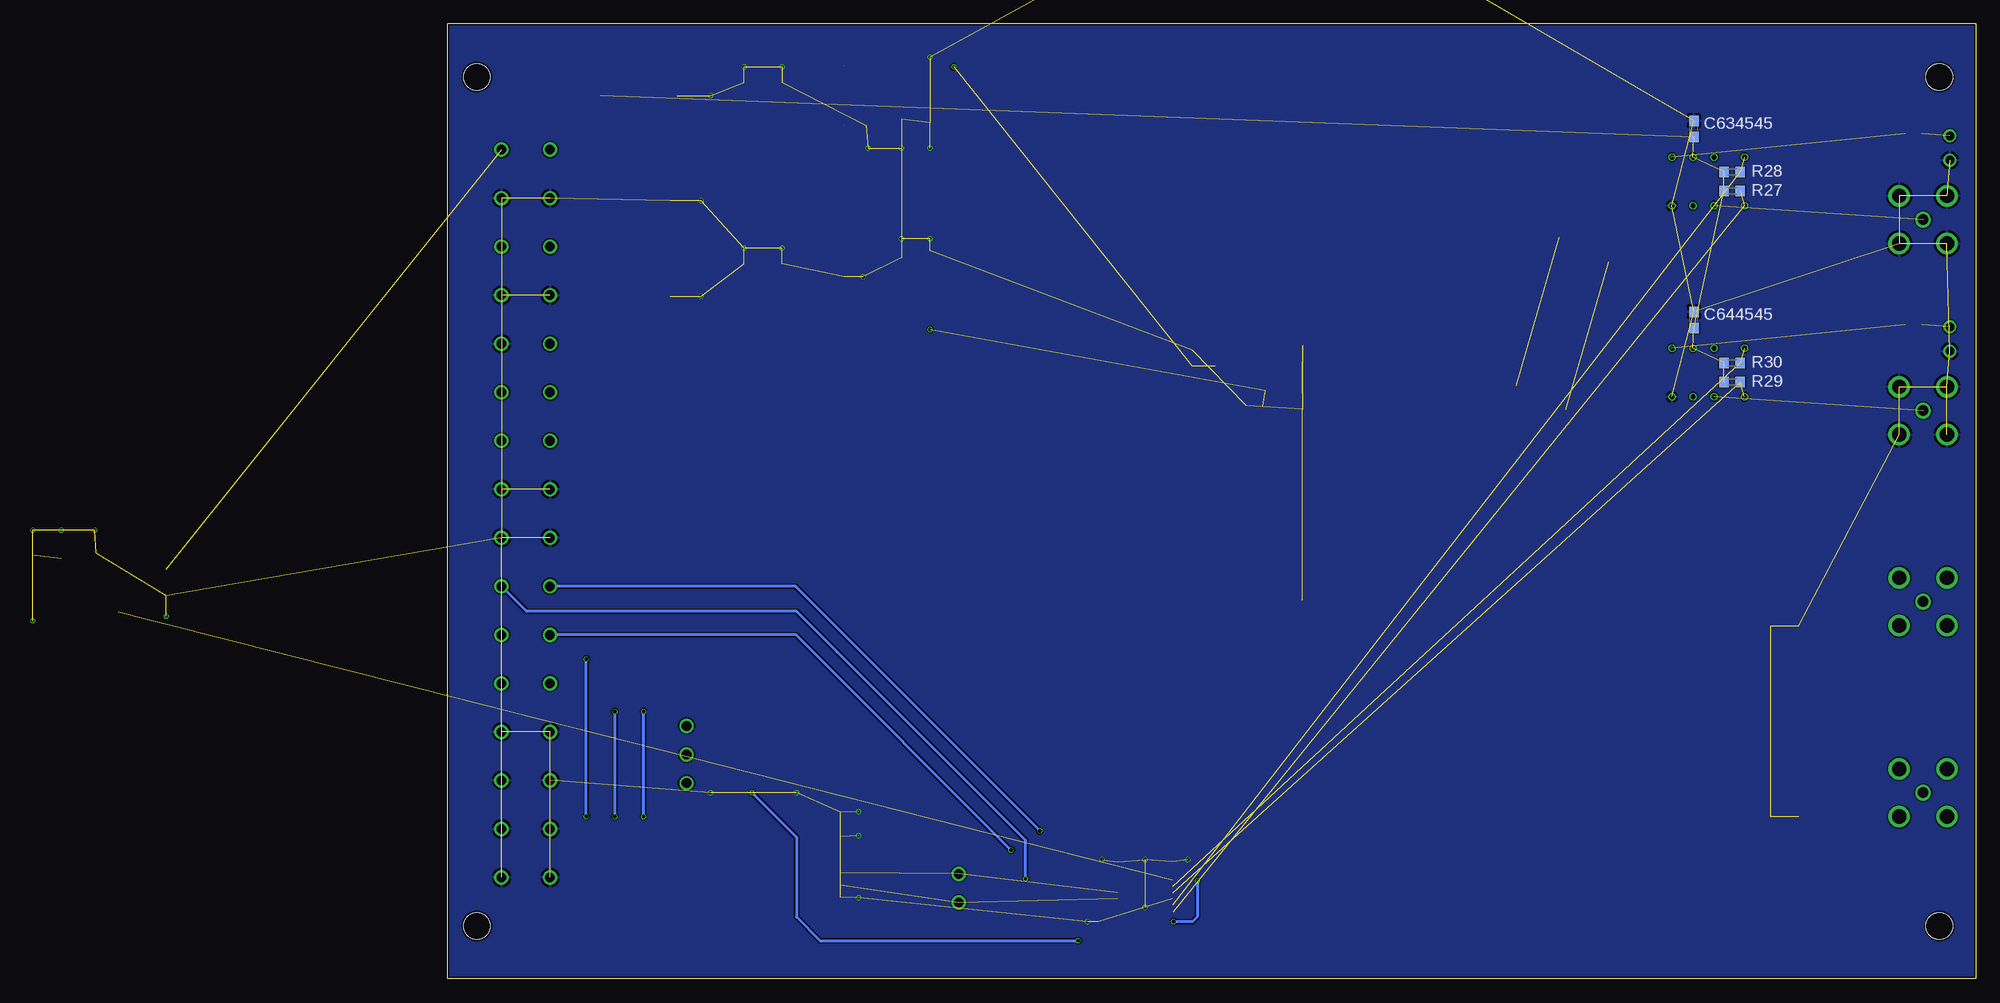
[diagram p6: board, bottom side, seen from below]

Size 160 x 100 mm. Coordinates in mm from the lower left corner, seen from the top.
Outline: 0,0 160,0 160,100 0,100 0,0
Copper layers (1*16): Top 0.035559375mm / dielectric 1.6mm / Bottom 0.035559375mm
Design rules "jlcpcb2layer": minimum track width 5mil, minimum drill 12mil, track to track 5mil, track to pad 5mil, pad to pad 5mil, via to via 5mil, smd to smd 5mil, copper to edge 8mil, drill to drill 6mil, minimum pad ring 5mil, minimum via ring 3mil, stop-mask expansion 2.5mil, vias tented up to drill 0mil, thermal gap 10mil

### Footprints (pad centres in the part's own frame; a part is rotated, then mirrored left to right if it is on the bottom)
153CLV-1010 = smd 4 x 2.5: + 4,0; - -4,0
153CLV-0810 = smd 3.5 x 2.5: + 3.25,0; - -3.25,0
CT3216 = smd 2 x 1.2: + -1.4,0; - 1.4,0
CT6032 = smd 2.6 x 2.2: + -2.5,0; - 2.5,0
C0603 = smd 1.1 x 1: 1 -0.85,0; 2 0.85,0
09031326921 = drill 1: 1 36.83,10.7; 2 36.83,5.62; 3 31.75,10.7; 4 31.75,5.62; 5 26.67,10.7; 6 26.67,5.62; 7 21.59,10.7; 8 21.59,5.62; 9 16.51,10.7; 10 16.51,5.62; 11 11.43,10.7; 12 11.43,5.62; 13 6.35,10.7; 14 6.35,5.62; 15 1.27,10.7; 16 1.27,5.62; 17 -3.81,10.7; 18 -3.81,5.62; 19 -8.89,10.7; 20 -8.89,5.62; 21 -13.97,10.7; 22 -13.97,5.62; 23 -19.05,10.7; 24 -19.05,5.62; 25 -24.13,10.7; 26 -24.13,5.62; 27 -29.21,10.7; 28 -29.21,5.62; 29 -34.29,10.7; 30 -34.29,5.62; 31 -39.37,10.7; 32 -39.37,5.62 | hole 2.8: -44.45,3.05; 44.45,3.05
DELOCK_65848 = drill 1.5: G1 -2.5,2.5; G2 2.5,2.5; G3 -2.5,-2.5; G4 2.5,-2.5 | drill 1.1: S 0,0
2337019-1 = smd 1.05 x 2.2: G1 1.475,0; G2 -1.475,0 | smd 1 x 1.05: S 0,-1.525
SOT223 = smd 2.235 x 1.219: 1 -3.099,2.311; 2 -3.099,0; 3 -3.099,-2.311 | smd 2.2 x 3.6: TAB 3.099,0
L79L05ACUTR = smd 2 x 0.57: 1 -1.475,1.5; 3 -1.475,-1.5 | smd 2 x 0.65: 2 -1.475,0
SO08 = smd 0.6 x 2.2: 1 -1.905,-2.6; 2 -0.635,-2.6; 3 0.635,-2.6; 4 1.905,-2.6; 5 1.905,2.6; 6 0.635,2.6; 7 -0.635,2.6; 8 -1.905,2.6
TCA9534ADWR = smd 2.06 x 0.6: 1 -4.64,4.445; 2 -4.64,3.175; 3 -4.64,1.905; 4 -4.64,0.635; 5 -4.64,-0.635; 6 -4.64,-1.905; 7 -4.64,-3.175; 8 -4.64,-4.445; 9 4.64,-4.445; 10 4.64,-3.175; 11 4.64,-1.905; 12 4.64,-0.635; 13 4.64,0.635; 14 4.64,1.905; 15 4.64,3.175; 16 4.64,4.445
VLS6045AF-101M = smd 2.3 x 5.5: 1 -2.1,0; 2 2.1,0
CHIP-LED0603 = smd 0.8 x 0.8: A 0,-0.75; C 0,0.75
113-305-04 = drill 0.9: + -1.27,0; - 1.27,0
LT1028CS8 = smd 0.6 x 2.2: 1 -1.905,-2.6; 2 -0.635,-2.6; 3 0.635,-2.6; 4 1.905,-2.6; 5 1.905,2.6; 6 0.635,2.6; 7 -0.635,2.6; 8 -1.905,2.6
60807-011 = hole 2.8: 0,44.45; 0,-44.45
R0603 = smd 1 x 1.1: 1 -0.85,0; 2 0.85,0
MAX4820EUP+ = smd 1.48 x 0.41: 1 -2.875,2.925; 2 -2.875,2.275; 3 -2.875,1.625; 4 -2.875,0.975; 5 -2.875,0.325; 6 -2.875,-0.325; 7 -2.875,-0.975; 8 -2.875,-1.625; 9 -2.875,-2.275; 10 -2.875,-2.925; 11 2.875,-2.925; 12 2.875,-2.275; 13 2.875,-1.625; 14 2.875,-0.975; 15 2.875,-0.325; 16 2.875,0.325; 17 2.875,0.975; 18 2.875,1.625; 19 2.875,2.275; 20 2.875,2.925 | smd 2.84 x 4.04: 21 0,0
5-1462037-8 = drill 0.5: 1 -2.54,3.8; 2 -2.54,0.6; 3 -2.54,-1.6; 4 -2.54,-3.8; 5 2.54,-3.8; 6 2.54,-1.6; 7 2.54,0.6; 8 2.54,3.8
RSPRO-1MM-TERMINAL-POST-2622034 = drill 1: P$1 0,0

### Placement (x,y rotation side)
C1  140,92.5 0 top
C2  140,81.5 0 top
C3  140,71.5 180 top
C4  189.5,41.5 270 top  (outside the outline)
C5  200.5,41.5 90 top  (outside the outline)
C6  129,92.5 90 top
C7  125,92.5 90 top
C8  112.5,92.5 270 top
C9  129,73.5 270 top
C10  125,73.5 270 top
C11  112.5,73 270 top
C57  82,65 270 top
C58  75.5,60 0 top
C61  70.5,60.5 270 top
C62  70.5,40.5 270 top
C65  125.5,19.5 180 top
C66  130.5,19.5 0 top
C99  91,6 0 top
C634545  29.5,89 90 bottom
C644545  29.5,69 90 bottom
CON_BACKPLANE  160,50 90 top
CON_IN_CH1  5.5,79.5 0 top
CON_IN_CH2  5.5,59.5 0 top
CON_INT_CH1  20,37 180 top
CON_INT_CH2  20,17 180 top
CON_OUT_CH1  5.5,39.5 0 top
CON_OUT_CH2  5.5,19.5 0 top
IC1  194.5,41.5 270 top  (outside the outline)
IC2  118.5,92.5 90 top
IC3  120,72 0 top
IC9  77,63.5 270 top
IC11  123.5,13 0 top
L1  127,86 180 top
L2  127,67 0 top
LED_+3.3V  203.5,39.5 0 top  (outside the outline)
LED_+5V_FRONTEND  109.5,94.5 180 top
LED_-5V_FRONTEND  109.5,75.5 180 top
LED_SHORT_CH1  2.7,87 270 top
LED_SHORT_CH2  2.7,67 270 top
OP1  41,77 270 top
OP2  45.5,61.5 270 top
PCB_BRACKET  3.8,50 0 top
R1  203.5,43.5 90 top  (outside the outline)
R2  109.5,90.5 270 top
R3  109.5,71.5 270 top
R27  25.5,82.5 180 bottom
R28  25.5,84.5 180 bottom
R29  25.5,62.5 180 bottom
R30  25.5,64.5 180 bottom
R33  70.5,65.5 270 top
R34  70.5,45.5 270 top
R3164654  6.5,88.5 180 top
R3245454  6.5,68.5 180 top
RD  87,10 180 top
RELAY1  28,83.5 90 top
RELAY2  28,63.5 90 top
TP_FDA1_IN  111.5,118 0 top  (outside the outline)
TP_FDA2_IN  131.5,118 0 top  (outside the outline)
TP_GND1  58,106.5 180 top  (outside the outline)
TP_GND2  67.5,106.5 180 top  (outside the outline)
TP_GND3  78.5,107 180 top  (outside the outline)
TP_GND4  90.5,107 180 top  (outside the outline)
TP_I2C_NINT  135,26.5 0 top
TP_I2C_SCL  135,20.5 0 top
TP_I2C_SDA  135,23.5 0 top
TP_RD_NRESET  106.5,8 0 top
TP_RD_SPI_NCS  106.5,11 0 top

### Tracks (layer width: path | path; a pad name or v marks a point on that pad's centre or on a via)
+3V3  (via drill 0.35)  (1 unrouted)
  Top 0.305: 200.75,38.75 LED_+3.3V.A 204.1,38.15 | 200.75,38.75 C5.+ | RD.15 81.53,10.32 v81.5,10.3 | v84,6 90,6 | 90,6 C99.1 | RD.2 RD.1 89.88,6.12 90,6 | v94,4 91,4 90,5 90,6 | IC11.16 v128.14,19.5 | C65.1 v128.14,19.5 | C66.1 v128.14,19.5 | IC1.2 IC1.TAB 200.4,38.4 200.75,38.75
  Bottom 0.305: v81.5,10.3 81.5,6.5 82,6 v84,6 | v128.14,19.5 123.5,14.86 123.5,6.5 121,4 v94,4
+5V  (9 unrouted)
  Top 0.305: C4.+ 191.2,44.6 IC1.3
  Top 1.016: CON_BACKPLANE.2 CON_BACKPLANE.1 | CON_BACKPLANE.1 149.17,86.83 149,87 149.13,87 CON_BACKPLANE.1 | CON_BACKPLANE.1 144,92.13 C1.+
+5V_FRONTEND  (via drill 0.35)  (4 unrouted)
  Top 0.305: v107,95.5 109.25,95.5 LED_+5V_FRONTEND.A 112.5,95.25 C8.+ 112.5,95.6 IC2.TAB IC2.2
+12V
  Top 0.305: C6.+ 129.1,91 L1.1
  Top 1.016: CON_BACKPLANE.5 146.33,76.67 143.25,79.75 C2.+ 138.75,86 L1.1
-5V_FRONTEND  (via drill 0.35)  (2 unrouted)
  Top 0.305: IC3.3 C11.- 109.65,70.5 R3.2 v109.5,68
-12V
  Top 0.305: 129,67.1 L2.2 129.1,72 C9.-
  Top 1.016: CON_BACKPLANE.6 151.71,74 145.75,74 C3.- 138.75,67 L2.2
GND  (via drill 0.35)  (101 unrouted)
  other vias: 133.5,71.5 133.5,81.5 132.5,92.5 200.5,47 203.5,47 197,47 189.5,38 203.5,37.5 129,95.5 125,95.5 116,87 112.5,87 109.5,87 109.5,96.5 129,76.5 125,76.5 112.5,77.5 116.5,73.5 109.5,77.5 93,6 132.5,19.5 123.5,19.5 117,8.5 91.5,12.5 82.5,12.5 87,7.5 87,12.5 117,17.5 117,15
  pour Bottom: 0,0 0,100 160,100 160,0
  pour Top: 0,0 0,100 160,100 160,0
I2C_NINT  (via drill 0.35)
  Top 0.305: TP_I2C_NINT.P$1 142,33.5 v145.5,33.5 151.85,33.5 CON_BACKPLANE.22 | IC11.13 142.13,13.63 v145.5,17
  Bottom 0.305: v145.5,17 v145.5,33.5
I2C_SCL  (via drill 0.35)
  Top 0.305: TP_I2C_SCL.P$1 v142.5,28 143,28.5 151.93,28.5 CON_BACKPLANE.24 | IC11.14 140.41,14.9 v142.5,17
  Bottom 0.305: v142.5,17 v142.5,28
I2C_SDA  (via drill 0.35)
  Top 0.305: TP_I2C_SDA.P$1 v139.5,28 142.45,30.95 CON_BACKPLANE.23 | IC11.15 138.68,16.18 v139.5,17
  Bottom 0.305: v139.5,17 v139.5,28
N$12
  Top 0.305: LED_+5V_FRONTEND.C R2.1
N$13
  Top 0.305: L1.2 125,86.1 C7.+ 123.3,89.4 IC2.3
N$15
  Top 0.305: L2.1 125,67.1 C10.- 124.9,72 IC3.2
N$20  (1 unrouted)
N$23
  Top 0.305: LED_-5V_FRONTEND.C R3.1
N$27  (1 unrouted)
N$49
  Top 0.305: LED_+3.3V.C R1.1
N$54  (1 unrouted)
N$55  (1 unrouted)
N$56  (1 unrouted)
N$58  (1 unrouted)
N$59  (1 unrouted)
N$60  (1 unrouted)
RD_NRESET  (2 unrouted)
RD_OUT1  (2 unrouted)
  Top 0.305: RD.20 84.05,7
RD_OUT2  (2 unrouted)
RD_OUT3  (2 unrouted)
  Top 0.305: RD.17 84.1,9
RD_OUT4  (2 unrouted)
RD_SPI_NCS  (2 unrouted)
SPI_CONFIG_CLK  (via drill 0.35)
  Top 0.305: RD.6 97.83,10.32 v101,13.5
  Bottom 0.305: CON_BACKPLANE.21 123.53,36.03 v101,13.5
SPI_CONFIG_MISO  (via drill 0.35)
  Top 0.305: RD.7 93.47,10.97 v98,15.5
  Bottom 0.305: CON_BACKPLANE.19 123.61,41.11 v98,15.5
SPI_CONFIG_MOSI  (via drill 0.35)
  Top 0.305: RD.5 98.67,9.68 v99.5,10.5
  Bottom 0.305: v99.5,10.5 99.5,14.5 119.25,34.25 119.5,34.5 123.5,38.5 151.77,38.5 CON_BACKPLANE.20
V+  (1 unrouted)
V-  (1 unrouted)

### Text on the board
tPlace: ANALOG FRONTEND / v1, pd, 2022